# EasyEDA Pro project N630电调_立创EDA专业版工程.epro, board PCB1
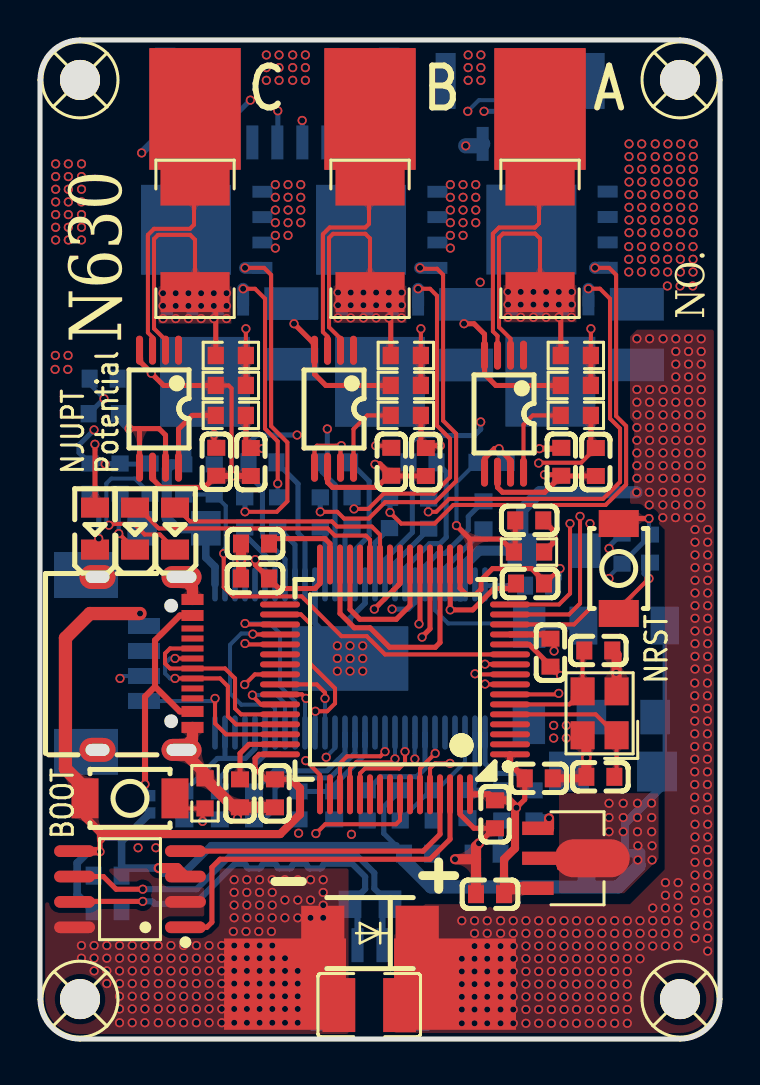
[diagram p5: board, top side]
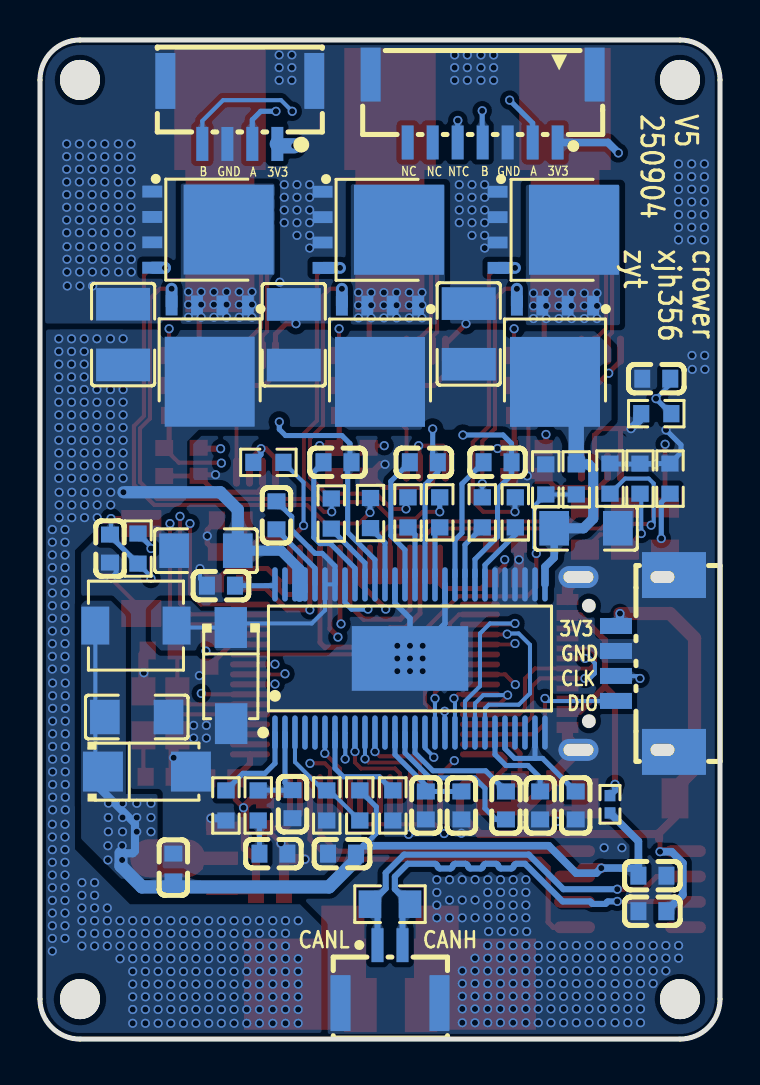
[diagram p6: board, bottom side, seen from below]

Outline 34 x 50 mm; copper layers: Top Layer, Inner1, Inner2, Bottom Layer. Coordinates in mm from the lower left corner of the outline.
Outline path: 0,48 0,2 arc(0.59,0.59) 2,0 32,0 arc(33.41,0.59) 34,2 34,48 arc(33.41,49.41) 32,50 2,50 arc(0.59,49.41) 0,48
Stack: Top Layer 0.035mm 外层铜厚1oz / Dielectric1 0.2104mm 7628 RC49% 8.6mil / Inner1 0.0152mm 内层铜厚 / Dielectric2 1.065mm 1.1mm H/HOZ Copper / Inner2 0.0152mm 内层铜厚 / Dielectric3 0.2104mm 7628 RC49% 8.6mil / Bottom Layer 0.035mm 外层铜厚1oz

## Design rules (mm)
net CANL: DP1
net CANH: DP1
template: 自定义配置
spacing copperThickness1oz (default): track to track 0.102, other pairs 0.152 to 0.3
spacing copperThickness2oz: track to track 0.203, other pairs 0.152 to 0.3
track width copperThickness1oz (default): min 0.127, default 0.254, max 2.54
track width copperThickness2oz: min 0.203, default 0.254, max 2.54
differential pair differentialPair (default): width min 0.127, default 0.254, max 2.54; gap min 0.152, default 0.152
via viaSize (default): diameter min 0.399, default 0.399, max 10; hole min 0.201, default 0.201, max 6.299
net PH_A uses pwr
net PH_C uses pwr
net SUPPLY uses pwr

## Placement (name value [footprint] x y rotation side)
C2  15pF  [C0603]  28.02 13.12 180 top
C3  2.2uF  [C0603]  10.75 24.8 0 top
C4  2.2uF  [C0603]  10 12.3 270 top
C5  2.2uF  [C0603]  24.94 13.05 180 top
C6  2.2uF  [C0603]  25.52 19.34 90 top
C7  100nF  [C0603]  30.5 24.55 270 bottom
C8  15pF  [C0603]  27.91 19.45 0 top
C9  2.2uF  [C0603]  24.5 22.8 180 top
C10  2.2uF  [C0603]  11.75 12.3 90 top
C11  2.2uF  [C0603]  22.75 11.25 90 top
C12  2.2uF  [C0603]  10.75 23.05 0 top
C13  10uF  [C0603]  27.33 8.58 270 bottom
C14  2.2uF  [C0603]  12.93 11.69 90 bottom
C15  2.2uF  [C0603]  14.71 11.69 90 bottom
C16  6.8nF  [C0603]  22.33 9.28 180 bottom
C17  2.2uF  [C0603]  8.99 11.69 90 bottom
C18  120pF  [C0603]  21.38 11.76 270 bottom
C19  22nF  [C0603]  10.7 11.69 90 bottom
C20  2.2uF  [C0603]  7.21 11.69 90 bottom
C22  15nF  [C0603]  24.95 22.69 180 bottom
C23  220nF  [C0603]  19.12 28.86 180 bottom
C24  220nF  [C0603]  14.81 28.86 0 bottom
C25  220nF  [C0603]  11.12 28.86 0 bottom
C26  4.7uF  [C1206]  25.7 24.44 180 bottom
C27  4.7uF  [C1206]  6.7 25.56 0 bottom
C28  100nF  [C0603]  22.18 26.21 90 bottom
C29  4.7nF  [C0603]  27.79 28.88 90 top
C30  4.7nF  [C0603]  19.29 28.88 90 top
C31  2.2uF  [C0603]  18.9 9.28 180 bottom
C32  100uF  [C1206]  29.16 16.12 0 bottom
C33  2.2uF  [C0603]  3.38 8.18 0 bottom
C34  2.2uF  [C0603]  3.38 6.4 180 bottom
C35  2.2uF  [C0603]  26.06 28.89 270 top
C36  2.2uF  [C0603]  24.46 25.96 180 top
C37  10uF  [C1210]  29.84 35.26 270 bottom
C38  2.2uF  [C0603]  17.56 28.89 270 top
C40  10uF  [C1210]  21.31 35.25 270 bottom
C42  2.2uF  [C0603]  8.81 28.89 270 top
C43  10uF  [C1210]  12.56 35.29 270 bottom
C45  4.7nF  [C0603]  10.54 28.88 90 top
C58  100nF  [C0603]  3.19 33.05 180 bottom
C64  10uF  [C0603]  22.5 7.25 0 top
C65  10uF  [C1210]  16.46 1.7 180 top
D1  NCD0805R1  [LED0805-R-RD]  2.75 25.55 90 top
D2  KT-0805Y  [LED0805-R-RD]  4.75 25.55 90 top
D3  KT-0805G  [LED0805-R-RD]  6.75 25.55 90 top
D4  SS56  [SMA_L4.3-W2.6-LS5.0-RD]  24.45 18.19 270 bottom
D5  SMAJ5.0A  [SMA_L4.3-W2.6-LS5.2-RD]  28.65 13.38 180 bottom
D6  SMBJ26A  [SMB_L4.4-W3.6-LS5.3-L-RD]  16.5 5.3 180 top
L2  22uH  [IND-SMD_L4.6-W4.2_SMMS0420]  29.2 20.69 180 bottom
NOREF  -  [Pad_e36]  16.5 46.55 90 top
NOREF#2  -  [Pad_e1962]  12.25 2.75 0 top
NOREF#3  -  [Pad_e702]  20.75 2.75 0 top
NOREF#4  -  [Pad_e74]  25 46.55 90 top
NOREF#5  -  [Pad_e10]  7.75 46.55 90 top
P2  WAFER-GH1.25-2PWB  [CONN-TH_2P-P1.25_XUNPU_WAFER-GH1.25-2PWB]  16.5 3.25 180 bottom
P7  532610471  [CONN-SMD_4P-P1.25_53261-0471]  3.75 18.8 90 bottom
P13  WAFER-GH1.25-7PWB  [CONN-SMD_7P-P1.25_FWF12514-S07B24W5M]  11.87 46.57 0 bottom
P14  WAFER-GH1.25-4PWB  [CONN-SMD_4P-P1.25_XUNPU_WAFER-GH1.25-4PWB]  24.01 46.37 0 bottom
Q1  PSMN1R8-40YLC,115  [SOT-669_L4.9-W4.0-P1.27-LS6.0-BL]  25.52 34.81 0 bottom
Q2  PSMN1R8-40YLC,115  [SOT-669_L4.9-W4.0-P1.27-LS6.0-BL]  26.48 40.51 270 bottom
Q3  PSMN1R8-40YLC,115  [SOT-669_L4.9-W4.0-P1.27-LS6.0-BL]  17 34.8 0 bottom
Q4  PSMN1R8-40YLC,115  [SOT-669_L4.9-W4.0-P1.27-LS6.0-BL]  17.96 40.5 270 bottom
Q5  PSMN1R8-40YLC,115  [SOT-669_L4.9-W4.0-P1.27-LS6.0-BL]  8.25 34.8 0 bottom
Q6  PSMN1R8-40YLC,115  [SOT-669_L4.9-W4.0-P1.27-LS6.0-BL]  9.21 40.5 270 bottom
R1  NC  [R0402]  5.5 11.75 270 bottom
R2  10kΩ  [R0603]  29.1 24.55 90 bottom
R3  10kΩ  [R0603]  8.25 12.3 270 top
R7  1kΩ  [R0603]  2.5 28.05 270 bottom
R8  220Ω  [R0603]  4 28.05 270 bottom
R9  220Ω  [R0603]  5.5 28.05 270 bottom
R10  3.3kΩ  [R0603]  19.66 11.69 270 bottom
R11  18kΩ  [R0603]  18.01 11.69 90 bottom
R12  15kΩ  [R0603]  23.09 11.69 270 bottom
R13  10kΩ  [R0603]  16.36 11.69 270 bottom
R14  220kΩ  [R0603]  24.7 11.69 270 bottom
R15  39kΩ  [R0603]  7.19 28.01 90 bottom
R16  2.2kΩ  [R0603]  8.71 28.01 90 bottom
R17  39kΩ  [R0603]  26.79 34.21 180 top
R18  2.2kΩ  [R0603]  26.79 32.71 180 top
R19  39kΩ  [R0603]  18.29 34.21 180 top
R20  2.2kΩ  [R0603]  18.29 32.71 180 top
R21  39kΩ  [R0603]  9.54 34.21 180 top
R22  2.2kΩ  [R0603]  9.54 32.71 180 top
R23  NC(120R)  [R0805]  16.5 6.75 180 bottom
R24  1mΩ  [RES-SMD_L6.3-W3.2_R2512]  25 40.05 270 top
R25  4.7Ω  [R0603]  19.44 26.3 90 bottom
R26  4.7Ω  [R0603]  17.47 26.32 90 bottom
R27  KNTC0603/10KF3950  [R0603]  22.58 28.86 0 bottom
R28  10kΩ  [R0603]  24.45 24.37 180 top
R29  1mΩ  [RES-SMD_L6.3-W3.2_R2512]  16.5 40.05 270 top
R30  4.7Ω  [R0603]  15.6 26.36 90 bottom
R31  4.7Ω  [R0603]  14.01 26.36 90 bottom
R32  1mΩ  [RES-SMD_L6.3-W3.2_R2512]  7.75 40.05 270 top
R33  4.7Ω  [R0603]  11.89 26.36 90 bottom
R34  4.7Ω  [R0603]  10.23 26.36 90 bottom
R35  100Ω  [R0603]  26.79 31.21 180 top
R36  100Ω  [R0603]  18.29 31.21 180 top
R37  100Ω  [R0603]  9.54 31.21 180 top
R39  10kΩ  [R0603]  3.19 31.3 0 bottom
TP1  -  [M2螺丝]  2 2 0 top
TP2  -  [M2螺丝]  2 48 0 top
TP3  -  [M2螺丝]  32 48 0 top
TP4  -  [M2螺丝]  32 2 0 top
U1  STM32F405RGT6  [LQFP-64_L10.0-W10.0-P0.50-LS12.0-BL]  17.75 18 90 top
U2  ME6118A33PG  [SOT-89-3_L4.5-W2.5-P1.50-LS4.2-BR]  26.25 9.05 180 top
U4  TJA1051T/3/1J  [SOIC-8_L4.9-W3.9-P1.27-LS6.0-BL]  4.5 7.5 90 top
U5  INA240A2PWR  [TSSOP-8_L4.4-W3.0-P0.65-LS6.4-BL]  23.2 31.3 180 top
U6  INA240A2PWR  [TSSOP-8_L4.4-W3.0-P0.65-LS6.4-BL]  14.7 31.55 180 top
U7  INA240A2PWR  [TSSOP-8_L4.4-W3.0-P0.65-LS6.4-BL]  5.95 31.55 180 top
U8  GT-TC029A-H030-L1N  [SW-SMD_L3.9-W2.9-P4.15-LS5.0]  28.94 23.55 90 top
U9  DRV8301DCA  [HTSSOP-56_L14.0-W6.0-P0.50-LS8.1-BL-EP]  15.5 19.05 180 bottom
U10  GT-TC029A-H030-L1N  [SW-SMD_L3.9-W2.9-P4.15-LS5.0]  4.5 12.05 180 top
USB1  TYPE-C 16PIN 2MD(073)  [USB-C-SMD_TYPE-C-6PIN-2MD-073]  5.25 18.8 270 top
X1  8MHz  [CRYSTAL-SMD_4P-L3.2-W2.5-BL]  27.98 16.3 90 top

## Footprints (pads in the part's own frame, mm; a bottom-side part is the same pattern mirrored in y, then rotated)
C0603
  rect 0.8x0.9 smd: 1(-0.7,0) 2(0.7,0)
C1206
  rect 1.485x1.728 smd: 1(-1.593,0) 2(1.593,0)
C1210
  rect 1.635x2.7 smd: 1(-1.518,0) 2(1.518,0)
CONN-SMD_4P-P1.25_53261-0471
  rect 0.8x1.6 smd: 1(-1.875,1.45) 2(-0.625,1.45) 3(0.625,1.45) 4(1.875,1.45)
  rect 2.3x3.2 smd: 5(4.425,-1.45) 6(-4.425,-1.45)
CONN-SMD_4P-P1.25_XUNPU_WAFER-GH1.25-4PWB
  rect 0.6x1.7 smd: 1(-1.875,1.575) 2(-0.625,1.575) 3(0.625,1.575) 4(1.875,1.575)
  rect 1x2.8 smd: 5(3.725,-1.575) 6(-3.725,-1.575)
CONN-SMD_7P-P1.25_FWF12514-S07B24W5M
  rect 0.6x1.7 smd: 1(-3.75,1.7) 2(-2.5,1.7) 3(-1.25,1.7) 4(0,1.7) 5(1.25,1.7) 6(2.5,1.7) 7(3.75,1.7)
  rect 1x2.7 smd: 8(-5.6,-1.7) 9(5.6,-1.7)
CONN-TH_2P-P1.25_XUNPU_WAFER-GH1.25-2PWB
  rect 0.6x1.7 smd: 1(-0.625,1.45) 2(0.625,1.45)
  rect 1x2.8 smd: 3(-2.475,-1.45) 4(2.475,-1.45)
CRYSTAL-SMD_4P-L3.2-W2.5-BL
  rect 1.4x1.2 smd: 1(-1.1,-0.85) 2(1.1,-0.85) 3(1.1,0.85) 4(-1.1,0.85)
HTSSOP-56_L14.0-W6.0-P0.50-LS8.1-BL-EP
  oval 0.28x1.715 smd: 1(-6.75,-3.708) 2(-6.25,-3.708) 3(-5.75,-3.708) 4(-5.25,-3.708) 5(-4.75,-3.708) 6(-4.25,-3.708) 7(-3.75,-3.708) 8(-3.25,-3.708) 9(-2.75,-3.708) 10(-2.25,-3.708) 11(-1.75,-3.708) 12(-1.25,-3.708) 13(-0.75,-3.708) 14(-0.25,-3.708) 15(0.25,-3.708) 16(0.75,-3.708) 17(1.25,-3.708) 18(1.75,-3.708) 19(2.25,-3.708) 20(2.75,-3.708) 21(3.25,-3.708) 22(3.75,-3.708) 23(4.25,-3.708) 24(4.75,-3.708) 25(5.25,-3.708) 26(5.75,-3.708) 27(6.25,-3.708) 28(6.75,-3.708) 29(6.75,3.708) 30(6.25,3.708) 31(5.75,3.708) 32(5.25,3.708) 33(4.75,3.708) 34(4.25,3.708) 35(3.75,3.708) 36(3.25,3.708) 37(2.75,3.708) 38(2.25,3.708) 39(1.75,3.708) 40(1.25,3.708) 41(0.75,3.708) 42(0.25,3.708) 43(-0.25,3.708) 44(-0.75,3.708) 45(-1.25,3.708) 46(-1.75,3.708) 47(-2.25,3.708) 48(-2.75,3.708) 49(-3.25,3.708) 50(-3.75,3.708) 51(-4.25,3.708) 52(-4.75,3.708) 53(-5.25,3.708) 54(-5.75,3.708) 55(-6.25,3.708) 56(-6.75,3.708)
  rect 5.825x3.235 smd: 57(0,0)
IND-SMD_L4.6-W4.2_SMMS0420
  rect 1.4x1.9 smd: 1(2.032,0) 2(-2.032,0)
LED0805-R-RD
  rect 1x1.399 smd: 1(1.05,0) 2(-1.05,0)
LQFP-64_L10.0-W10.0-P0.50-LS12.0-BL
  oval 0.3x2 smd: 1(-3.75,-5.75) 2(-3.25,-5.75) 3(-2.75,-5.75) 4(-2.25,-5.75) 5(-1.75,-5.75) 6(-1.25,-5.75) 7(-0.75,-5.75) 8(-0.25,-5.75) 9(0.25,-5.75) 10(0.75,-5.75) 11(1.25,-5.75) 12(1.75,-5.75) 13(2.25,-5.75) 14(2.75,-5.75) 15(3.25,-5.75) 16(3.75,-5.75) 33(3.75,5.75) 34(3.25,5.75) 35(2.75,5.75) 36(2.25,5.75) 37(1.75,5.75) 38(1.25,5.75) 39(0.75,5.75) 40(0.25,5.75) 41(-0.25,5.75) 42(-0.75,5.75) 43(-1.25,5.75) 44(-1.75,5.75) 45(-2.25,5.75) 46(-2.75,5.75) 47(-3.25,5.75) 48(-3.75,5.75)
  oval 2x0.3 smd: 17(5.75,-3.75) 18(5.75,-3.25) 19(5.75,-2.75) 20(5.75,-2.25) 21(5.75,-1.75) 22(5.75,-1.25) 23(5.75,-0.75) 24(5.75,-0.25) 25(5.75,0.25) 26(5.75,0.75) 27(5.75,1.25) 28(5.75,1.75) 29(5.75,2.25) 30(5.75,2.75) 31(5.75,3.25) 32(5.75,3.75) 49(-5.75,3.75) 50(-5.75,3.25) 51(-5.75,2.75) 52(-5.75,2.25) 53(-5.75,1.75) 54(-5.75,1.25) 55(-5.75,0.75) 56(-5.75,0.25) 57(-5.75,-0.25) 58(-5.75,-0.75) 59(-5.75,-1.25) 60(-5.75,-1.75) 61(-5.75,-2.25) 62(-5.75,-2.75) 63(-5.75,-3.25) 64(-5.75,-3.75)
M2螺丝
  round 2 hole 2: 1(0,0)
Pad_e10
  rect 6.096x4.572 smd: (0,0)
Pad_e36
  rect 6.096x4.572 smd: (0,0)
Pad_e74
  rect 6.096x4.572 smd: (0,0)
Pad_e702
  rect 6.096x4.572 smd: (0,0)
Pad_e1962
  rect 6.096x4.572 smd: (0,0)
R0402
  rect 0.566x0.54 smd: 1(-0.433,0) 2(0.433,0)
R0603
  rect 0.806x0.864 smd: 1(-0.753,0) 2(0.753,0)
R0805
  rect 1.133x1.377 smd: 1(-1,0) 2(1,0)
RES-SMD_L6.3-W3.2_R2512
  rect 2x3.456 smd: 1(-2.667,0) 2(2.667,0)
SMA_L4.3-W2.6-LS5.0-RD
  rect 2.046x1.62 smd: 1(-2.404,-0.009) 2(2.404,0.009)
SMA_L4.3-W2.6-LS5.2-RD
  rect 2x2 smd: 1(-2.2,0) 2(2.2,0)
SMB_L4.4-W3.6-LS5.3-L-RD
  rect 2.159x2.743 smd: 1(-2.36,0) 2(2.36,0)
SOIC-8_L4.9-W3.9-P1.27-LS6.0-BL
  oval 0.588x2.045 smd: 1(-1.905,-2.772) 2(-0.635,-2.772) 3(0.635,-2.772) 4(1.905,-2.772) 5(1.905,2.772) 6(0.635,2.772) 7(-0.635,2.772) 8(-1.905,2.772)
SOT-89-3_L4.5-W2.5-P1.50-LS4.2-BR
  rect 1.575x0.672 smd: 1(1.356,-1.5) 3(1.356,1.5)
  custom 5.377x1.9 smd: 2(-1.356,0)
SOT-669_L4.9-W4.0-P1.27-LS6.0-BL
  rect 0.595x1 smd: 1(-1.905,-1.909) 2(-0.635,-1.909) 3(0.635,-1.909) 4(1.905,-1.909)
  rect 4.5x4.5 smd: 5(0,1.909)
SW-SMD_L3.9-W2.9-P4.15-LS5.0
  rect 1.35x2 smd: 1(-2.25,0) 2(2.25,0)
TSSOP-8_L4.4-W3.0-P0.65-LS6.4-BL
  oval 0.353x1.454 smd: 1(-0.975,-2.927) 2(-0.325,-2.927) 3(0.325,-2.927) 4(0.975,-2.927) 5(0.975,2.927) 6(0.325,2.927) 7(-0.325,2.927) 8(-0.975,2.927)
USB-C-SMD_TYPE-C-6PIN-2MD-073
  rect 0.55x1.1 smd: 1(-3.2,2.375) 2(-2.4,2.375) 11(2.4,2.375) 12(3.2,2.375)
  rect 0.3x1.1 smd: 3(-1.75,2.375) 4(-1.25,2.375) 5(-0.75,2.375) 6(-0.25,2.375) 7(0.25,2.375) 8(0.75,2.375) 9(1.25,2.375) 10(1.75,2.375)
  oval 1.1x2 hole 0.6x1.5: 13(-4.325,1.825) 14(4.325,1.825)
  oval 1.2x1.8 hole 0.6x1.2: 13(-4.325,-2.375) 14(4.325,-2.375)

## Nets
As in the schematic, except:
GND: C2.2 C3.1 C4.2 C5.1 C6.1 C7.2 C8.2 C9.1 C10.1 C11.1 C12.1 C13.1 C14.1 C15.1 C16.2 C17.1 C18.2 C20.1 C22.1 C26.1 C27.1 C29.1 C30.1 C31.1 C32.1 C33.1 C34.1 C35.2 C36.1 C37.1 C38.2 C40.1 C42.2 C43.1 C45.1 C58.1 C64.1 C65.2 D4.2 D5.2 D6.2 NOREF#2. P2.3 P2.4 P7.3 P7.5 P7.6 P13.3 P13.8 P13.9 P14.3 P14.5 P14.6 Q2.1 Q2.2 Q2.3 Q4.1 Q4.2 Q4.3 Q6.1 Q6.2 Q6.3 R3.1 R7.1 R8.1 R9.1 R10.2 R13.2 R14.2 R16.2 R18.2 R20.2 R22.2 R28.1 U1.12 U1.18 U1.63 U2.1 U4.2 U4.8 U5.4 U5.6 U6.4 U6.6 U7.4 U7.6 U8.1 U9.28 U9.30 U9.31 U9.32 U9.33 U9.34 U9.39 U9.44 U9.57 USB1.1 USB1.12 USB1.13 USB1.14 X1.2 X1.4
PH_A: NOREF#4. R24.1 U5.3
PH_B: NOREF. R29.1 U6.3
PH_C: NOREF#5. R32.1 U7.3
SUPPLY: C26.2 C27.2 C37.2 C40.2 C43.2 C65.1 D6.1 NOREF#3. Q1.5 Q3.5 Q5.5 R15.2 U9.29 U9.53 U9.54

Pads without a net: P13 6 7; TP1 1; TP2 1; TP3 1; TP4 1; U1 2 3 4 28 50; U5 1; U6 1; U7 1; U9 4 5 12 25 26 55; USB1 3 4 9 10

## Via types
v1: diameter 0.457, hole 0.305, Top Layer to Bottom Layer, 769 vias

## Routing (per net, layer and track width the routed paths; a pad name or vN(x,y) marks a point on that pad's centre or on a via; arc(x,y) is an arc through that point)
+5V: length 51.4
  Top Layer w0.203: 25.95,8.55 27.11,8.55 U2.2
  Top Layer w0.508: v1(5.94,8.56) 6.85,8.56 U4.3
  Bottom Layer w0.203: L2.2 31.23,12.77 31.15,12.69
  Bottom Layer w0.254: R11.2 17.19,11.62 17.19,10.29 17.8,9.67
  Bottom Layer w0.381: 17.8,9.67 8.56,9.67 7.19,8.3 6.19,8.3 v1(5.94,8.56) 4.14,8.56 4.08,8.5 ; 4.08,8.5 C33.2 ; 4.08,8.5 4.08,9.9 R1.2
  Bottom Layer w0.406: 29.95,9.3 29.36,9.3 29.25,9.41 29.25,10.79 31.15,12.69
  Bottom Layer w0.66: C31.2 18.2,8.96 19.55,7.61 28.9,7.61 29.95,8.67 29.95,9.3
  vias: v1(28.45,11.8) v1(28.45,11.09) v1(28.45,10.38) v1(29.16,11.8) v1(29.16,11.09) v1(29.16,10.38) v1(29.87,11.8) v1(29.87,11.09) v1(29.87,10.38) v1(29.89,9.67) v1(29.89,8.96) v1(30.58,11.81) v1(30.58,11.09) v1(30.58,10.38) v1(30.6,9.67) v1(30.6,8.96)
GND: length 104.8
  Top Layer w0.203: v1(26,23.55) 25.25,22.8 C9.1 ; C4.2 10,11.18 v1(9.87,11.05) ; R22.2 9.43,32.71 9.58,32.56 9.58,28.24 v1(9.64,28.18) ; U8.1 28.94,21.53 v1(30.45,23.05)
  Top Layer w0.254: R20.2 14.29,32.71 13.73,33.27 U6.4 13.73,34.77 v1(12.7,35.8) ; v1(26.03,18.19) 25.58,18.64 C6.1 25.52,18.68 24.46,19.75 U1.12 ; C35.2 25.24,27.36 23.12,27.36 22.88,27.61 U5.6 ; C35.2 26.08,28.18 C29.1 ; C35.2 26.01,28.24 v1(25.22,28.24) ; C42.2 8.81,28.18 8.23,27.61 6.05,27.61 5.63,28.03 U7.6 ; R18.2 22.79,32.71 22.23,33.27 U5.4 22.23,35.27 21.7,35.8 v1(21.2,35.8) ; 25.19,22.93 24.58,23.54 22.62,23.54 22.05,22.97 22.05,22.5 21.79,22.25 21.31,22.25 21,22.56 U1.18 ; 25.16,25.96 25.64,25.48 v1(25.64,25.18) 25.64,24.81 R28.1 ; U6.6 14.38,27.86 14.63,27.61 16.84,27.61 17.47,28.24 16.95,28.76 ; 22.7,10.55 21.7,10.55 21,11.25 U1.63 ; 22.7,10.55 v1(21.95,9.8) ; 22.7,10.55 C11.1 ; U7.4 4.98,33.93 5.56,33.34 v1(5.56,33.32) 6.18,32.71 R22.2 ; C30.1 17.58,28.18
  Top Layer w0.28: C9.1 25.19,22.81 25.19,22.93
  Top Layer w0.305: C38.2 16.99,28.76 v1(16.75,28.76) ; C45.1 10.54,28.18 v1(9.64,28.18) 8.81,28.18
  Top Layer w0.406: C2.2 27.24,13.05 C5.1
  Top Layer w0.508: X1.4 27.32,15.01 v1(27.32,14.08) C2.2 ; 28.83,17.4 28.83,19.23 C8.2 ; 21.8,9 21.8,9.65 v1(21.95,9.8) ; 21.8,9 C64.1 ; 21.8,9 v1(20.75,9) ; C12.1 v1(10.05,23.99) C3.1 ; U2.1 25.45,10.55 25.45,10.55 v1(25.45,11.05)
  Top Layer w0.559: USB1.12 7.63,15.02 USB1.14 8.25,13.3 R3.1 9.7,11.6 C4.2 C10.1 ; USB1.1 7.63,22.57 7.08,23.12
  Bottom Layer w0.203: C22.1 26,23.04 v1(26,23.55) ; v1(21.2,35.8) 21.31,35.91 C40.1 ; C43.1 12.7,36.67 v1(12.7,35.8) ; 30.2,23.54 C7.2
  Bottom Layer w0.254: v1(2.7,30.49) 1.95,29.74 1.95,29.35 R7.1 R8.1 3.98,28.78 ; v1(30.45,23.05) 30.2,23.3 30.2,23.54 ; 3.98,28.78 5.48,28.78 R9.1 ; 3.98,28.78 v1(3.26,28.78)
  Bottom Layer w0.28: U9.39 13.75,20.8 v1(14.87,19.68) ; v1(15.5,19.05) v1(15.5,19.68) 15.5,21.06 16.25,21.81 U9.44
  Bottom Layer w0.406: R14.2 24.81,11.05 v1(25.45,11.05)
  vias: v1(0.78,43.8) v1(0.78,43.16) v1(0.78,42.53) v1(0.78,41.89) v1(0.78,41.26) v1(0.78,40.62) v1(0.78,39.99) v1(0.77,34.21) v1(0.75,33.51) v1(1.39,33.51) v1(1.42,43.8) v1(1.42,43.16) v1(1.42,42.53) v1(1.42,41.89) v1(1.42,41.26) v1(1.42,40.62) v1(1.42,39.99) v1(1.4,34.21) v1(2.08,43.8) v1(2.08,43.16) v1(2.08,42.53) v1(2.07,41.9) v1(2.07,41.26) v1(2.07,40.63) v1(2.07,39.99) v1(2.07,4.68) v1(2.07,4.05) v1(2.71,4.68) v1(2.71,4.05) v1(2.71,3.41) v1(3.34,4.68) v1(3.34,4.05) v1(3.34,3.41) v1(3.34,2.78) v1(3.98,4.68) v1(3.98,4.05) v1(3.98,3.41) v1(3.98,2.78) v1(3.98,2.14) v1(3.98,1.51) v1(3.98,0.82) v1(4.61,4.68) v1(4.61,4.05) v1(4.61,3.41) v1(4.61,2.78) v1(4.61,2.14) v1(4.61,1.51) v1(4.61,0.82) v1(4.9,9.57) v1(5.25,4.68) v1(5.25,4.05) v1(5.25,3.41) v1(5.25,2.78) v1(5.25,2.14) v1(5.25,1.51) v1(5.25,0.82) v1(5.79,9.57) v1(5.91,4.68) v1(5.91,4.05) v1(5.91,3.41) v1(5.91,2.78) v1(5.91,2.14) v1(5.91,1.51) v1(5.91,0.82) v1(6.55,4.68) v1(6.55,4.05) v1(6.55,3.41) v1(6.55,2.78) v1(6.55,2.14) v1(6.55,1.51) v1(6.55,0.82) v1(7.18,4.68) v1(7.18,4.05) v1(7.18,3.41) v1(7.18,2.78) v1(7.18,2.14) v1(7.18,1.51) v1(7.18,0.82) v1(7.82,4.68) v1(7.82,4.05) v1(7.82,3.41) v1(7.82,2.78) v1(7.82,2.14) v1(7.82,1.51) v1(7.82,0.82) v1(8.45,4.68) v1(8.45,4.05) v1(8.45,3.41) v1(8.45,2.78) v1(8.45,2.14) v1(8.45,1.51) v1(8.45,0.82) v1(9.09,4.68) v1(9.09,4.05) v1(9.09,3.41) v1(9.09,2.78) v1(9.09,2.14) v1(9.09,1.51) v1(9.09,0.82) v1(9.67,5.38) v1(9.71,7.98) v1(9.71,7.34) v1(9.71,6.71) v1(9.71,6.07) v1(9.71,4.68) v1(9.71,4.05) v1(9.71,3.41) v1(9.71,2.78) v1(9.71,2.14) v1(9.71,1.51) v1(9.71,0.82) v1(10.34,7.98) v1(10.34,7.34) v1(10.34,6.71) v1(10.34,6.07) v1(10.3,5.38) v1(10.34,4.68) v1(10.34,4.05) v1(10.34,3.41) v1(10.34,2.78) v1(10.34,2.14) v1(10.34,1.51) v1(10.34,0.82) v1(10.98,7.98) v1(10.98,7.34) v1(10.98,6.71) v1(10.98,6.07) v1(10.94,5.38) v1(10.98,4.68) v1(10.98,4.05) v1(10.98,3.41) v1(10.98,2.78) v1(10.98,2.14) v1(10.98,1.51) v1(10.98,0.82) v1(11.32,49.25) v1(11.32,48.61) v1(11.32,47.98) v1(11.57,5.38) v1(11.61,7.98) v1(11.61,7.34) v1(11.61,6.71) v1(11.61,6.07) v1(11.62,4.68) v1(11.62,4.05) v1(11.62,3.41) v1(11.62,2.78) v1(11.62,2.14) v1(11.62,1.51) v1(11.62,0.82) v1(11.77,42.76) v1(11.77,42.12) v1(11.77,41.49) v1(11.77,40.85) v1(11.77,40.22) v1(11.77,39.58) v1(11.95,49.25) v1(11.95,48.61) v1(11.95,47.98) v1(12.25,7.98) v1(12.25,6.96) v1(12.25,6.07) v1(12.25,4.05) v1(12.25,3.41) v1(12.25,2.78) v1(12.25,2.14) v1(12.25,1.51) v1(12.25,0.82) v1(12.4,42.76) v1(12.4,42.12) v1(12.4,41.49) v1(12.4,40.85) v1(12.4,40.22) v1(12.63,49.25) v1(12.63,48.62) v1(12.63,47.98) v1(12.89,7.97) v1(12.89,6.96) v1(12.89,6.07) v1(12.89,3.41) v1(12.89,2.78) v1(12.89,2.14) v1(12.89,1.51) v1(12.89,0.82) v1(12.93,10.3) v1(13.04,42.76) v1(13.04,42.12) v1(13.04,41.49) v1(13.04,40.85) v1(13.27,49.25) v1(13.27,48.62) v1(13.27,47.98) v1(13.52,7.97) v1(13.52,6.96) v1(13.52,6.07) v1(14.16,7.97) v1(14.16,7.34) v1(14.16,6.7) v1(14.16,6.07) v1(14.87,19.05) v1(14.87,18.41) v1(15.5,18.41) v1(15.57,10.25) v1(16.14,19.68) v1(16.14,19.05) v1(16.14,18.41) v1(20.52,42.76) v1(20.52,42.12) v1(20.52,41.49) v1(20.52,40.85) v1(20.52,40.22) v1(20.52,39.58) v1(21.15,42.76) v1(21.15,42.12) v1(21.15,41.49) v1(21.15,40.85) v1(21.15,40.22) v1(21.41,49.25) v1(21.41,48.62) v1(21.41,47.98) v1(21.79,42.76) v1(21.79,42.12) v1(21.79,41.49) v1(21.79,40.85) v1(22.04,49.25) v1(22.04,48.62) v1(22.04,47.98) v1(22.01,37.88) v1(25.68,15.7) v1(25.68,15.06) v1(26.32,15.7) v1(26.32,15.06) v1(28.81,18.33) v1(29.45,44.8) v1(29.45,44.16) v1(29.45,43.53) v1(29.45,42.89) v1(29.45,42.26) v1(29.45,41.62) v1(29.45,40.99) v1(29.45,40.35) v1(29.44,39.66) v1(29.44,39.02) v1(29.44,38.39) v1(30.09,44.8) v1(30.09,44.16) v1(30.09,43.53) v1(30.09,42.89) v1(30.09,42.26) v1(30.09,41.62) v1(30.09,40.99) v1(30.09,40.35) v1(30.07,39.66) v1(30.07,39.02) v1(30.07,38.39) v1(30.76,44.8) v1(30.76,44.16) v1(30.76,43.53) v1(30.76,42.89) v1(30.76,42.26) v1(30.76,41.62) v1(30.76,40.99) v1(30.76,40.35) v1(30.75,39.66) v1(30.75,39.02) v1(30.75,38.39) v1(31.4,44.8) v1(31.4,44.16) v1(31.4,43.53) v1(31.4,42.89) v1(31.4,42.26) v1(31.4,41.62) v1(31.4,40.99) v1(31.4,40.35) v1(31.38,39.66) v1(31.38,39.02) v1(31.38,38.39) v1(31.37,37.69) v1(32.03,44.8) v1(32.03,44.16) v1(32.03,43.53) v1(32.03,42.89) v1(32.03,42.26) v1(32.03,41.62) v1(32.03,40.99) v1(32.03,40.35) v1(32.02,39.66) v1(32.02,39.02) v1(32.02,38.39) v1(32,37.69) v1(32.67,44.8) v1(32.67,44.16) v1(32.67,43.53) v1(32.67,42.89) v1(32.67,42.26) v1(32.67,41.62) v1(32.67,40.99) v1(32.67,40.35) v1(32.65,39.66) v1(32.65,39.02) v1(32.65,38.39) v1(32.64,37.69)
VCC: length 195.9
  Top Layer w0.203: U6.5 13.73,29.57 13.85,29.7 v1(15.07,29.7) 15.03,29.66 U6.7 ; C38.1 17.46,29.7 v1(16.79,29.7)
  Top Layer w0.254: v1(23.82,11.58) 24.24,11.99 C5.2 ; 4.99,30.55 4.98,30.54 U7.5 ; 4.99,30.55 v1(4.45,30.55) ; 4.99,30.55 5.95,30.55 6.28,30.22 U7.7 ; v1(25.7,19.42) 25.7,19.86 C6.2 ; U5.7 23.53,28.97 v1(22.95,29.55) 22.72,29.55 22.23,29.06 U5.5 ; C42.1 8.7,29.7 v1(8.7,30.26) ; D1.1 2.75,29.76 v1(2.74,29.77) ; U1.19 20.51,23.74 v1(20.51,21.48) 21.63,21.48 22.7,22.55 23.5,22.55 23.75,22.8 C9.2 ; 12.55,13 C10.2 11.3,13 10.75,13.55 10.75,14.05 10.95,14.25 U1.48 ; U1.32 14,22.8 13.75,22.55 11.95,22.55 C12.2 10.76,23.73 v1(10.76,23.99) ; v1(3,9.38) 3,9.95 3.05,10
  Top Layer w0.305: U1.1 23.5,13.79 C5.2 ; C11.2 22.45,12.25 U1.64 ; U1.13 25.31,20.25 C6.2 ; C35.1 26.02,29.55 v1(24.97,29.55)
  Top Layer w0.406: 12.55,13 13,12.55 13,11.25 12.01,10.26 3.05,10.26 ; 3.05,10.26 3.05,10 ; 3.05,10.26 3.05,10.31 2.25,11.11 U10.2 ; v1(3,9.38) 2.97,9.41 U4.5 ; C11.2 23.45,11.95 v1(23.82,11.58) 23.75,11.51 23.75,9.55 23.2,9 C64.2
  Top Layer w0.61: U2.3 23.5,7.55 C64.2
  Top Layer w0.66: U10.2 2.25,12.55 1.27,13.53 1.27,20.07 2.5,21.3 v1(5,21.3)
  Inner1 w0.254: v1(10.76,23.99) 10.76,22.8
  Inner1 w0.305: v1(24.97,29.55) v1(22.95,29.55) 20.92,29.55 20.24,30.23 19.8,30.23 19.26,29.7 v1(16.79,29.7) v1(15.07,29.7) 11.96,29.7 11.4,30.26 v1(8.7,30.26) 7.04,30.26 6.68,29.89 4.89,29.89
  Inner1 w0.559: v1(20.51,21.48) 20.51,21.47 20.5,21.46 ; v1(25.7,19.42) 25.19,19.42 ; 20.5,21.46 17.66,21.46 v1(17.6,21.52) 17.6,21.56 16.37,22.8 9.45,22.8 7.95,24.3 5,24.3 v1(5,21.3) ; 20.5,21.46 20.91,21.06 20.91,17.37 21.46,16.81 23.82,16.81 23.82,16.81 ; 4.78,29.77 v1(2.74,29.77)
  Inner1 w0.66: 4.75,30.04 4.78,30.01 4.78,29.77 5,29.77 5,24.3 ; v1(28.45,24.55) 28.45,24.45 28.34,24.34 25.76,24.34 25.19,23.76 25.19,18.17 23.82,16.81 v1(23.82,11.58)
  Inner1 w0.762: v1(21.29,44.7) 5.54,44.7 4.75,43.92 4.75,30.04
  Bottom Layer w0.254: v1(17.6,21.52) 18.42,21.52 18.75,21.85 18.75,22.75 ; R2.2 28.45,24.65 v1(28.45,24.55) ; 23.33,28.86 22.95,29.24 v1(22.95,29.55)
  Bottom Layer w0.381: v1(3,9.38) 2.42,9.38 1.86,8.81 1.86,7.22 C34.2 ; v1(5.08,44.35) 5.6,44.87 P13.1
  Bottom Layer w0.406: v1(4.45,30.55) 4.04,30.96 4.04,31.19 R39.2 ; v1(5,21.3) 5,20.67
  Bottom Layer w0.762: v1(21.29,44.7) 22.04,44.7 22.13,44.8
ADC_TEMP: length 9.9
  Top Layer w0.254: U1.17 21.5,25.02 ; 21.5,25.02 v1(20.82,25.7) ; 21.5,25.02 23.05,25.02 R28.2 23.76,24.44 C36.2
  Bottom Layer w0.203: R27.1 20.82,27.86 v1(20.82,25.7)
AN_IN: length 22.2
  Top Layer w0.203: v1(9.19,24.3) 9.19,22.61 9.64,22.15 13.08,22.15 15.07,20.16 16.34,20.16 17.25,19.25 U1.11
  Bottom Layer w0.203: v1(9.19,24.3) 9.19,24.49 9.29,24.59 9.29,26.68 R16.1 R15.1
BOOT0: length 21.8
  Top Layer w0.203: U10.1 7.25,11.54 R3.2 8.13,11.42 v1(8.13,10.9) ; v1(20.5,13.8) 19.75,13.8 19.5,13.55 U1.60
  Inner1 w0.203: v1(8.13,10.9) 9.34,10.9 9.67,10.57 10.07,10.57 10.4,10.9 12.84,10.9 12.94,11 13.5,11 13.77,11.27 13.77,14.31 14.2,14.74 14.81,14.74 16.5,13.05 19.25,13.05 20,13.8 v1(20.5,13.8)
C_A: length 4.4
  Top Layer w0.203: U5.8 24.18,30.75 24.63,31.21 R35.2
C_B: length 4.1
  Top Layer w0.203: R36.2 16.36,31.21 15.68,30.52 U6.8
C_C: length 4
  Top Layer w0.254: U7.8 6.93,30.52 7.61,31.21 R37.2
CAN_RX: length 15.1
  Top Layer w0.254: U1.61 20,10.25 19.16,9.41 U4.4
CAN_TX: length 18.9
  Top Layer w0.254: U4.1 8.34,5.59 8.59,5.85 8.59,8.59 9,9 19.5,9 20.5,10 U1.62
CANH: length 20.4
  Top Layer w0.254: U4.7 1.75,6.89 v1(5.14,6.89)
  Bottom Layer w0.305: v1(5.14,6.89) 5.61,6.89 arc(5.65,6.87) 5.67,6.83 arc(5.69,6.78) 5.73,6.76 6.37,6.76 arc(6.41,6.78) 6.43,6.83 arc(6.45,6.87) 6.5,6.89 7.87,6.89 9.75,8.77 10.2,8.77 arc(10.28,8.74) 10.32,8.66 arc(10.35,8.57) 10.44,8.54 10.96,8.54 arc(11.04,8.57) 11.08,8.66 arc(11.11,8.74) 11.2,8.77 11.72,8.77 arc(11.81,8.74) 11.84,8.66 arc(11.88,8.57) 11.96,8.54 12.49,8.54 arc(12.57,8.57) 12.6,8.66 arc(12.64,8.74) 12.72,8.77 13.25,8.77 arc(13.33,8.74) 13.37,8.66 arc(13.4,8.57) 13.48,8.54 14.01,8.54 arc(14.09,8.57) 14.13,8.66 arc(14.16,8.74) 14.25,8.77 15.61,8.77 16.26,8.13 16.26,7.51 R23.2 15.88,6.38 P2.2
CANL: length 20.4
  Top Layer w0.254: U4.6 3.17,8.13 3.8,7.5 v1(5.14,7.5)
  Bottom Layer w0.305: v1(5.14,7.5) 7.83,7.5 9.56,9.23 15.8,9.23 16.71,8.32 16.71,7.54 R23.1 17.12,6.38 P2.1
CS: length 15.1
  Top Layer w0.203: v1(10.23,17.74) 10.74,18.25 U1.40
  Inner1 w0.203: v1(18.74,14.02) 18.27,13.55 17.96,13.55 17.95,13.54 16.76,13.54 15.25,15.05 10.75,15.05 10.14,15.66 10.14,17.64 v1(10.23,17.74)
  Bottom Layer w0.203: U9.8 18.73,15.32 18.73,14.19 18.74,14.18 v1(18.74,14.02)
CURRENT_1: length 19.2
  Top Layer w0.203: v1(24.93,28.82) 24.95,28.84 27.06,28.84 C29.2 ; v1(22.25,17.77) 22.27,17.75 U1.8
  Top Layer w0.254: C29.2 27.54,29.83 R35.1
  Inner1 w0.203: v1(24.93,28.82) 24.15,28.82 23.7,28.37 23.7,18.56 22.9,17.77 v1(22.25,17.77)
CURRENT_2: length 19.1
  Top Layer w0.203: v1(21.75,18.28) 21.78,18.25 U1.9
  Top Layer w0.254: 19.41,29.7 19.1,29.7 19.04,29.75 R36.1 ; 19.41,29.7 v1(20.02,29.7) ; 19.41,29.7 C30.2
  Inner1 w0.203: v1(21.75,18.28) 22.61,18.28 23.06,18.74 23.06,27.86 22.18,28.75 20.52,28.75 20.02,29.26 v1(20.02,29.7)
CURRENT_3: length 24.9
  Top Layer w0.203: U1.10 23.49,18.76 v1(22.25,18.76)
  Top Layer w0.254: v1(11.12,29.55) 10.57,29.55 ; 10.57,29.55 10.55,29.55 10.29,29.81 R37.1 ; 10.57,29.55 C45.2
  Inner1 w0.203: v1(22.25,18.76) 22.5,19.01 22.5,27.24 21.46,28.28 11.77,28.28 11.12,28.92 v1(11.12,29.55)
EN_GATE: length 11.2
  Top Layer w0.203: v1(13.79,10.29) 14.26,10.75 17.8,10.75 18,10.95 U1.57
  Inner1 w0.203: v1(13.79,10.29) 14.07,10.56 14.07,13.86 v1(14.31,14.1)
  Bottom Layer w0.203: U9.16 14.75,14.56 14.31,14.12 v1(14.31,14.1)
FAULT: length 3.4
  Top Layer w0.203: U1.59 19,13.54 v1(19.76,14.3)
  Bottom Layer w0.203: v1(19.76,14.3) 19.76,15.33 U9.6
GH_A: length 3.1
  Bottom Layer w0.254: 17.75,23.14 17.75,23.83 19.44,25.51 R25.1
GH_B: length 2.6
  Bottom Layer w0.254: R30.1 15.25,25.25 15.25,23.14
GH_C: length 2.8
  Bottom Layer w0.254: 12.75,23.14 12.75,24.74 R33.1
GL_A: length 2.7
  Bottom Layer w0.254: R26.1 17.47,25.56 16.75,24.84 16.75,23.14
GL_B: length 2.6
  Bottom Layer w0.254: R31.1 14.25,25.37 14.25,23.14
GL_C: length 3.1
  Bottom Layer w0.254: R34.1 10.23,25.24 11.75,23.73 11.75,23.14
H1: length 4.4
  Top Layer w0.203: v1(14.25,17.05) 14.25,17.33 13.84,17.75 U1.41
  Bottom Layer w0.203: v1(14.25,17.05) U9.17
H2: length 3.1
  Top Layer w0.203: U1.42 13.1,17.25 v1(13.3,17.05)
  Bottom Layer w0.203: v1(13.3,17.05) 13.25,17 U9.19
H3: length 4.9
  Top Layer w0.203: U1.43 11.05,16.75 10.62,17.18 v1(10.62,17.21)
  Bottom Layer w0.203: U9.21 12.25,16.8 11.83,17.21 v1(10.62,17.21)
HALL_1: length 1.8
  Top Layer w0.203: U1.37 10.3,19.75 v1(10.25,19.8)
INL_A: length 8.4
  Top Layer w0.203: U1.34 13.05,21.25 13.5,20.8 13.5,18.8 14.75,17.55 14.75,16.8 14.36,16.41 v1(13.77,16.41)
  Bottom Layer w0.203: v1(13.77,16.41) 13.77,15.36 U9.18
INL_B: length 9
  Top Layer w0.203: U1.35 10.3,20.75 v1(10.25,20.8)
  Bottom Layer w0.203: U9.20 12.75,16.91 12,17.66 12,20.3 11.5,20.8 v1(10.25,20.8)
INL_C: length 9
  Top Layer w0.203: v1(10.64,20.27) 10.66,20.25 U1.36
  Bottom Layer w0.203: U9.22 11.75,16.55 11.56,16.73 10.06,16.73 9.5,17.3 9.5,19.73 10.07,20.3 10.61,20.3 v1(10.64,20.27)
LED_GREEN: length 12.3
  Top Layer w0.203: U1.26 17,25.24 16.59,25.65 14.85,25.65 14.59,25.91 7.5,25.91 6.8,26.6 D3.1
LED_RED: length 13.7
  Top Layer w0.203: U1.27 16.5,24.99 16.29,25.2 14.74,25.2 14.38,25.56 5.94,25.56 4.9,26.6 D2.1
MISO_ADC_EXT2: length 73.7
  Top Layer w0.254: U1.22 19,20.83 v1(18.95,20.78)
  Inner1 w0.203: v1(21.39,46.43) 21.36,46.46 v1(11.89,46.46) 4.34,46.46 3.35,45.46 3.35,32.89 1.39,30.92 1.39,20.94 2.19,20.14 6.69,20.14 8.42,21.87 15.42,21.87 16.51,20.78 v1(18.95,20.78)
  Bottom Layer w0.203: v1(21.39,46.43) 21.95,46.99 24.84,46.99 25.88,45.95 25.88,44.8
  Bottom Layer w0.254: v1(11.89,46.46) 11.89,44.89 P13.4
NRST: length 15.5
  Top Layer w0.203: v1(25.94,17.3) 25.89,17.25 U1.7
  Top Layer w0.254: U8.2 29.19,26.05 v1(30.45,26.05)
  Inner1 w0.203: v1(28.45,23.05) 27.14,23.05 26.62,22.53 26.62,17.96 25.96,17.3 v1(25.94,17.3)
  Bottom Layer w0.203: v1(30.45,26.05) 30.45,25.3 C7.1 ; R2.1 28.45,23.14 v1(28.45,23.05)
  Bottom Layer w0.254: C7.1 30.5,25.19 R2.1
PH_A: length 14.2
  Top Layer w0.203: 22.88,34.54 22.88,35.19 22.65,35.42 22.65,40.31 22.95,40.61 24.75,40.61 24.95,40.82 24.95,43.13 25,43.18
  Top Layer w0.254: 25,46.55 25,43.11
PH_B: length 14.2
  Top Layer w0.203: 16.5,43.15 16.45,43.1 16.45,40.8 16.27,40.62 14.48,40.62 14.15,40.28 14.15,35.39 14.38,35.16 14.38,34.51
  Top Layer w0.254: 16.5,46.55 16.5,43.11
PH_C: length 14.2
  Top Layer w0.203: 7.75,43.11 7.7,43.06 7.7,40.75 7.5,40.55 5.7,40.55 5.4,40.24 5.4,35.35 5.63,35.12 U7.3
  Top Layer w0.254: 7.75,46.55 7.75,43.11
RX_SDA_NSS: length 12.2
  Top Layer w0.254: U1.20 20,19.84 19.76,19.61 17.48,19.61 16.5,20.58 15.72,20.58 15,21.3 U1.30
SCK_ADC_EXT: length 74.5
  Top Layer w0.254: U1.21 19.5,20.53 19.1,20.13 v1(19.1,20.12)
  Inner1 w0.203: v1(19.1,20.12) 16.66,20.12 15.29,21.49 8.54,21.49 6.83,19.78 2.05,19.78 1.04,20.79 1.04,31.26 2.87,33.09 2.87,45.74 4.07,46.94 21.69,46.94 v1(22.2,46.43)
  Bottom Layer w0.254: v1(22.2,46.43) 22.96,46.43 23.38,46.01 23.38,44.8 ; v1(10.52,46.99) 9.37,45.84 P13.2
SCLK: length 5
  Top Layer w0.203: v1(17.25,14.39) 17.02,14.15 15.35,14.15 15,13.8 U1.51
  Bottom Layer w0.203: v1(17.25,14.39) U9.11
SDI: length 5
  Top Layer w0.203: v1(18.25,14.39) 18.25,13.84 17.95,13.54 16.24,13.54 16,13.3 U1.53
  Bottom Layer w0.203: U9.9 v1(18.25,14.39)
SDO: length 5.1
  Top Layer w0.203: v1(17.75,14.02) 17.57,13.85 15.8,13.85 15.5,13.55 U1.52
  Bottom Layer w0.203: U9.10 v1(17.75,14.02)
SENS_A: length 21.2
  Top Layer w0.203: R17.1 v1(27.54,35.55) ; v1(27.5,25.8) 27.5,21.55 26.7,20.75 U1.14
  Top Layer w0.254: R17.1 R18.1
  Inner1 w0.203: v1(27.54,35.55) 27.5,35.5 v1(27.5,25.8)
SENS_B: length 27.3
  Top Layer w0.203: R19.1 v1(19.04,35.55) ; v1(27,26.16) 27,21.8 26.45,21.25 U1.15
  Top Layer w0.254: R19.1 R20.1
  Inner1 w0.203: v1(19.04,35.55) 19.04,31.75 19.79,31.01 21.06,31.01 21.67,30.4 26.62,30.4 27,30.02 v1(27,26.16)
SENS_C: length 34.5
  Top Layer w0.203: v1(26.5,25.8) 26.5,22.3 25.95,21.75 U1.16 ; R21.1 v1(10.29,35.55)
  Top Layer w0.254: R21.1 R22.1
  Inner1 w0.203: v1(26.5,25.8) 26.5,29.72 26.19,30.03 21.28,30.03 20.65,30.66 15.34,30.66 14.74,30.05 13.97,30.05 12.22,31.8 10.75,31.8 10.29,32.25 v1(10.29,35.55)
SH_A: length 32.5
  Top Layer w0.203: 23.53,34.54 23.53,35.05 22.95,35.63 22.95,40.11 23.15,40.31 24.76,40.31 25,40.06 25,37.05
  Top Layer w0.254: R17.2 26.04,36.76 25.82,36.98 25,36.98
  Inner1 w0.203: v1(23.4,36.12) 23.4,31.5 22.78,30.88 v1(22.03,30.88)
  Bottom Layer w0.254: 17.25,23.14 17.25,23.99 18.62,25.35 18.62,28.67 C23.2 18.5,28.94 18.5,29.8 18.91,30.2 21.72,30.2 22.03,30.51 v1(22.03,30.88)
  vias: v1(23.4,37.39) v1(23.4,36.76) v1(24.04,37.39) v1(24.04,36.76) v1(24.04,36.12) v1(24.67,37.39) v1(24.67,36.76) v1(24.67,36.12) v1(25.31,37.39) v1(25.31,36.76) v1(25.31,36.12) v1(25.94,37.39) v1(25.94,36.76) v1(25.94,36.12) v1(26.58,37.39) v1(26.58,36.76) v1(26.58,36.12)
SH_B: length 28.4
  Top Layer w0.203: 16.5,37.05 16.5,40.07 16.27,40.3 14.65,40.3 14.45,40.1 14.45,35.63 15.03,35.05 15.03,34.54
  Top Layer w0.254: 16.5,36.98 17.07,36.98 17.54,36.51 R19.2
  Inner1 w0.254: v1(14.9,36.09) 14.9,31.07 v1(14.37,30.53)
  Bottom Layer w0.254: v1(14.37,30.53) 14.37,29.12 C24.1 14.11,28.38 14.75,27.74 14.75,22.89
  vias: v1(14.9,37.36) v1(14.9,36.73) v1(15.54,37.36) v1(15.54,36.73) v1(15.54,36.09) v1(16.17,37.36) v1(16.17,36.73) v1(16.17,36.09) v1(16.81,37.36) v1(16.81,36.73) v1(16.81,36.09) v1(17.44,37.36) v1(17.44,36.73) v1(17.44,36.09) v1(18.08,37.36) v1(18.08,36.73) v1(18.08,36.09)
SH_C: length 33.1
  Top Layer w0.203: 7.75,36.98 7.75,40 7.51,40.24 5.9,40.24 5.7,40.04 5.7,35.56 6.28,34.99 U7.2
  Top Layer w0.254: 7.75,36.98 8.32,36.98 8.79,36.51 R21.2
  Inner1 w0.254: v1(12.85,30.23) 12.44,30.23 11.63,31.04 10.01,31.04 9.33,31.72 v1(9.33,36.06)
  Bottom Layer w0.254: 12.25,23.14 12.25,24.01 11.12,25.13 11.12,27.53 10.42,28.23 C25.1 10.42,29.81 10.84,30.23 v1(12.85,30.23)
  vias: v1(6.15,37.33) v1(6.15,36.69) v1(6.15,36.06) v1(6.79,37.33) v1(6.79,36.69) v1(6.79,36.06) v1(7.42,37.33) v1(7.42,36.69) v1(7.42,36.06) v1(8.06,37.33) v1(8.06,36.69) v1(8.06,36.06) v1(8.69,37.33) v1(8.69,36.69) v1(8.69,36.06) v1(9.33,37.33) v1(9.33,36.69)
SUPPLY: length 27.6
  Bottom Layer w0.254: U9.53 20.75,22.4 21.02,22.13 21.25,22.37 U9.54
  Bottom Layer w0.381: U9.29 8.75,23.63 8.29,24.09 C27.2
  Bottom Layer w0.508: 21.02,22.13 21.02,23.51 21.95,24.44 C26.2 ; R15.2 6.56,28.76 6.34,28.54 6.34,26.05 6.82,25.56 C27.2
  Bottom Layer w0.61: C26.2 24.11,26.49 24.98,27.37 v1(29.83,27.37)
  Bottom Layer w0.762: R15.2 7.19,31.82 Q5.5
  vias: v1(21.09,5.92) v1(21.09,4.02) v1(21.09,3.38) v1(21.09,2.75) v1(21.09,2.11) v1(21.09,1.48) v1(21.09,0.79) v1(21.73,5.92) v1(21.73,5.29) v1(21.73,4.66) v1(21.73,4.02) v1(21.73,3.38) v1(21.73,2.75) v1(21.73,2.11) v1(21.73,1.48) v1(21.73,0.79) v1(22.36,5.92) v1(22.36,5.29) v1(22.36,4.66) v1(22.36,4.02) v1(22.36,3.38) v1(22.36,2.75) v1(22.36,2.11) v1(22.36,1.48) v1(22.36,0.79) v1(23.03,5.92) v1(23.03,5.29) v1(23.03,4.66) v1(23.03,4.02) v1(23.03,3.38) v1(23.03,2.75) v1(23.03,2.11) v1(23.03,1.48) v1(23.03,0.79) v1(23.66,5.92) v1(23.66,5.29) v1(23.66,4.66) v1(23.66,4.02) v1(23.66,3.38) v1(23.66,2.75) v1(23.66,2.11) v1(23.66,1.48) v1(23.66,0.79) v1(24.3,5.92) v1(24.3,5.29) v1(24.3,4.66) v1(24.3,4.02) v1(24.3,3.38) v1(24.3,2.75) v1(24.3,2.11) v1(24.3,1.48) v1(24.3,0.79) v1(24.93,5.92) v1(24.93,5.29) v1(24.93,4.66) v1(24.93,4.02) v1(24.93,3.38) v1(24.93,2.75) v1(24.93,2.11) v1(24.93,1.48) v1(24.93,0.79) v1(25.57,5.92) v1(25.57,5.29) v1(25.57,4.66) v1(25.57,4.02) v1(25.57,3.38) v1(25.57,2.75) v1(25.57,2.11) v1(25.57,1.48) v1(25.57,0.79) v1(26.2,5.92) v1(26.2,5.29) v1(26.2,4.66) v1(26.2,4.02) v1(26.2,3.38) v1(26.2,2.75) v1(26.2,2.11) v1(26.2,1.48) v1(26.2,0.79) v1(26.83,5.92) v1(26.83,5.29) v1(26.83,4.66) v1(26.83,4.02) v1(26.83,3.38) v1(26.83,2.75) v1(26.83,2.11) v1(26.83,1.48) v1(26.83,0.79) v1(27.46,5.92) v1(27.46,5.29) v1(27.46,4.66) v1(27.46,4.02) v1(27.46,3.38) v1(27.46,2.75) v1(27.46,2.11) v1(27.46,1.48) v1(27.46,0.79) v1(28.09,5.92) v1(28.09,5.29) v1(28.09,4.66) v1(28.09,4.02) v1(28.09,3.38) v1(28.09,2.75) v1(28.09,2.11) v1(28.09,1.48) v1(28.09,0.79) v1(28.73,5.92) v1(28.73,5.29) v1(28.73,4.66) v1(28.73,4.02) v1(28.73,3.38) v1(28.73,2.75) v1(28.73,2.11) v1(28.73,1.48) v1(28.73,0.79) v1(29.37,5.92) v1(29.37,5.29) v1(29.37,4.66) v1(29.37,4.02) v1(29.37,3.38) v1(29.37,2.75) v1(29.37,2.11) v1(29.37,1.48) v1(29.37,0.79) v1(29.84,35.05) v1(29.84,32.51) v1(29.84,31.87) v1(29.84,31.24) v1(29.84,30.6) v1(29.84,29.97) v1(29.84,29.33) v1(29.84,28.7) v1(29.84,28.06) v1(30,5.92) v1(30,5.29) v1(30,4.66) v1(30,4.02) v1(30.48,35.05) v1(30.48,32.51) v1(30.48,31.87) v1(30.48,31.24) v1(30.48,30.6) v1(30.48,29.97) v1(30.48,29.33) v1(30.48,28.7) v1(30.48,28.06) v1(30.46,27.37) v1(30.46,26.73) v1(30.64,6.56) v1(30.64,5.92) v1(30.64,5.29) v1(30.64,4.66) v1(31.15,35.05) v1(31.15,32.51) v1(31.15,31.87) v1(31.15,31.24) v1(31.15,30.6) v1(31.15,29.97) v1(31.15,29.33) v1(31.15,28.7) v1(31.15,28.06) v1(31.14,27.36) v1(31.14,26.73) v1(31.14,26.09) v1(31.27,7.83) v1(31.27,7.19) v1(31.27,6.56) v1(31.27,5.92) v1(31.27,5.29) v1(31.27,4.66) v1(31.79,35.05) v1(31.79,34.41) v1(31.79,33.78) v1(31.79,33.14) v1(31.79,32.51) v1(31.79,31.87) v1(31.79,31.24) v1(31.79,30.6) v1(31.79,29.97) v1(31.79,29.33) v1(31.79,28.7) v1(31.79,28.06) v1(31.78,27.36) v1(31.78,26.73) v1(31.78,26.09) v1(31.91,7.83) v1(31.91,7.19) v1(31.91,6.56) v1(31.91,5.92) v1(31.91,5.29) v1(31.91,4.66) v1(32.42,35.05) v1(32.42,34.41) v1(32.42,33.78) v1(32.42,33.14) v1(32.42,32.51) v1(32.42,31.87) v1(32.42,31.24) v1(32.42,30.6) v1(32.42,29.97) v1(32.42,29.33) v1(32.42,28.7) v1(32.42,28.06) v1(32.41,27.36) v1(32.41,26.73) v1(32.41,26.09) v1(32.75,25.5) v1(32.75,24.86) v1(32.75,24.23) v1(32.75,23.59) v1(32.75,22.96) v1(32.75,22.32) v1(32.75,21.69) v1(32.75,21.06) v1(32.75,20.42) v1(32.75,19.79) v1(32.75,19.15) v1(32.75,18.52) v1(32.74,17.82) v1(32.74,17.18) v1(32.74,16.55) v1(32.74,15.91) v1(32.74,15.28) v1(32.74,14.64) v1(32.74,14.01) v1(32.74,13.38) v1(32.74,12.74) v1(32.74,12.11) v1(32.74,11.47) v1(32.75,10.75) v1(32.75,10.11) v1(32.75,9.48) v1(32.75,8.84) v1(32.75,8.21) v1(32.75,7.57) v1(32.75,6.94) v1(32.75,6.31) v1(32.75,5.67) v1(32.75,5.04) v1(33.06,35.05) v1(33.06,34.41) v1(33.06,33.78) v1(33.06,33.14) v1(33.06,32.51) v1(33.06,31.87) v1(33.06,31.24) v1(33.06,30.6) v1(33.06,29.97) v1(33.06,29.33) v1(33.06,28.7) v1(33.06,28.06) v1(33.05,27.36) v1(33.05,26.73) v1(33.05,26.09) v1(33.39,25.5) v1(33.39,24.86) v1(33.39,24.23) v1(33.39,23.59) v1(33.39,22.96) v1(33.39,22.32) v1(33.39,21.69) v1(33.38,21.06) v1(33.38,20.42) v1(33.38,19.79) v1(33.38,19.15) v1(33.38,18.52) v1(33.37,17.82) v1(33.37,17.18) v1(33.37,16.55) v1(33.37,15.91) v1(33.37,15.28) v1(33.37,14.64) v1(33.37,14.01) v1(33.37,13.38) v1(33.37,12.74) v1(33.37,12.11) v1(33.37,11.47) v1(33.39,10.75) v1(33.39,10.11) v1(33.39,9.48) v1(33.39,8.84) v1(33.39,8.21) v1(33.39,7.57) v1(33.39,6.94) v1(33.38,6.31) v1(33.38,5.67) v1(33.38,5.04) v1(33.38,4.4)
SWCLK: length 16.7
  Top Layer w0.203: v1(13.29,13.93) 14,13.22 U1.49
  Inner1 w0.203: v1(13.29,13.93) 12.9,13.55 4.5,13.55 4.25,13.8 4.25,17.8 v1(4,18.05)
  Bottom Layer w0.203: 5,18.17 4.12,18.17 v1(4,18.05)
SWDIO: length 8.5
  Top Layer w0.203: U1.46 9.3,15.25 8.75,15.8 v1(8.75,17.05)
  Bottom Layer w0.203: v1(8.75,17.05) 8.62,16.92 5,16.92
TEMP_MOTOR: length 57.1
  Top Layer w0.254: U1.24 18,22.8 17.93,22.73 17.93,22.72 17.68,22.47 17.67,22.47 v1(16.71,21.52)
  Inner1 w0.203: v1(13.11,45.97) 4.62,45.97 3.81,45.16 3.81,32.67 1.72,30.58 1.72,21.08 2.33,20.47 6.55,20.47 8.28,22.2 16.03,22.2 v1(16.71,21.52)
  Bottom Layer w0.203: C58.2 2.49,32.76 v1(3.2,32.05)
  Bottom Layer w0.254: P13.5 13.12,45.96 v1(13.11,45.97) ; v1(3.2,32.05) 2.45,31.3 R39.1
TX_SCL_MOSI: length 7.8
  Top Layer w0.254: U1.23 18.5,21.69 17.81,21.01 15.99,21.01 15.5,21.5 U1.29
USB_DM: length 9.7
  Top Layer w0.203: U1.44 10.05,16.25 9.75,16.55 9.75,18.05 9.25,18.55 USB1.7 6.5,18.55 6.25,18.8 6.25,19.3 6.5,19.55 7.62,19.55
USB_DP: length 9.7
  Top Layer w0.203: USB1.8 9,18.05 9.39,17.65 9.39,16.15 9.8,15.75 U1.45 ; USB1.6 v1(6.75,19.05) ; v1(6.75,18.05) 7.62,18.05
  Bottom Layer w0.203: v1(6.75,18.05) 6.5,18.05 6.26,18.29 6.26,18.8 6.5,19.05 v1(6.75,19.05)
$1N80571: length 12.9
  Top Layer w0.305: 5.75,17.64 5.75,19.96 6.99,21.2 USB1.2 ; 5.75,17.64 5.25,17.14 v1(5.25,12.75) ; 5.75,17.64 6.99,16.4 USB1.11
  Bottom Layer w0.305: v1(5.25,12.75) 5.25,12.43 5.5,12.18
$1N82503: length 8.8
  Top Layer w0.203: v1(3.44,25.72) 3.42,25.72 3.35,25.78 4.7,25.78 5.23,25.25 6,25.25 D3.2
  Bottom Layer w0.203: v1(3.44,25.72) 3.31,25.85 3.31,27.8 3.56,28.05 4.74,28.05 R9.2
$1N82508: length 3.1
  Top Layer w0.254: v1(2.94,25.05) 2.94,24.68 D1.2
  Bottom Layer w0.254: v1(2.94,25.05) 2.94,26.86 R7.2
$1N82510: length 3.2
  Top Layer w0.203: D2.2 3.95,25.3 v1(3.94,25.3)
  Bottom Layer w0.203: R8.2 3.94,27.23 v1(3.94,25.3)
$2N17028: length 6
  Top Layer w0.203: U1.6 26.47,16.75 X1.3 27.13,19.36 C8.1
$2N17034: length 4.3
  Top Layer w0.254: U1.31 14.5,24.79 14.25,25.05 11.7,25.05 C3.2
$2N17046: length 3.5
  Top Layer w0.254: U1.47 10.45,14.75 10,14.3 C4.1
$2N17057: length 7.9
  Top Layer w0.203: C2.1 28.83,13.23 28.83,15.2 27.78,16.25 U1.5
$3N7256: length 4.1
  Bottom Layer w0.254: 22.31,25.63 22.32,25.64 22.32,25.62 22.31,25.63 ; 22.31,25.63 22.31,25.62 22.19,25.5 ; 22.31,25.63 22.19,25.51 22.19,25.5 ; 22.19,25.5 20.25,23.57 U9.52 ; 22.19,25.5 22.19,25.35
$3N7259: length 15.2
  Bottom Layer w0.203: L2.1 27.07,20.59 D4.1 24.26,20.8 20.41,20.8 19.75,21.46 U9.51 U9.50
  Bottom Layer w0.254: U9.50 19.25,23.67 19.89,24.31 20.25,24.31 21.41,25.47 21.41,26.15 C28.2
$3N7261: length 7.1
  Bottom Layer w0.254: 18.25,23.14 18.25,23.57 19.48,24.8 20,24.8 20.31,25.11 20.31,28.38 C23.1
$3N7263: length 6.4
  Bottom Layer w0.254: 15.75,23.14 15.75,24.48 16.46,25.19 16.46,27.91 C24.2
$3N7265: length 6.3
  Bottom Layer w0.254: 13.25,23.14 13.25,24.98 12.9,25.33 12.9,27.79 C25.2
$3N7281: length 5.9
  Bottom Layer w0.203: U9.3 21.25,13.86 19.83,12.45 R10.1 19.52,12.45 R11.1
$3N7282: length 1.7
  Bottom Layer w0.254: R12.2 23.03,10.88 C16.1
$3N7283: length 4.6
  Bottom Layer w0.254: U9.1 22.25,13.8 22.75,13.3 23.85,13.3 R14.1
$3N7285: length 4.8
  Bottom Layer w0.254: U9.2 21.75,12.83 C18.1 23.08,12.46 R12.1
$3N7287: length 5.1
  Bottom Layer w0.254: R13.1 17.04,13.13 18.83,13.13 19.25,13.55 U9.7
$3N7289: length 8
  Bottom Layer w0.254: C19.1 11.19,10.99 11.75,11.55 11.75,12.55 12.27,13.07 14.5,13.07 15.75,14.32 U9.14
$3N7290: length 6.4
  Bottom Layer w0.254: C19.2 10.7,12.41 11.72,13.43 14.35,13.43 15.25,14.32 U9.15
$3N7291: length 5.4
  Bottom Layer w0.254: C14.2 C15.2 14.71,12.7 16.25,14.24 U9.13
$3N7294: length 6.5
  Bottom Layer w0.254: U9.24 10.75,14.53 10.27,14.05 9.25,14.05 ; 9.25,14.05 8.87,14.05 C20.2 ; 9.25,14.05 9.25,15.34 U9.27
$3N7296: length 4.5
  Bottom Layer w0.254: C17.2 8.99,13.08 9.6,13.69 10.7,13.69 11.25,14.24 U9.23
$3N10171: length 2
  Bottom Layer w0.254: C22.2 22.31,22.69 U9.56
$4N40844: length 21.2
  Top Layer w0.203: v1(14.01,26.39) 14.86,26.39 15.2,26.05 16.44,26.05 17.26,26.87 19.76,26.87 20.81,27.92 20.81,30.3 20.15,30.95 20.15,38.24 19.85,38.55 19.05,38.55 v1(19,38.59)
  Bottom Layer w0.254: R31.2 v1(14.01,26.39)
  Bottom Layer w0.595: 19.87,38.59 v1(19,38.59)
$4N41325: length 26.1
  Top Layer w0.203: v1(27.75,38.59) 28.45,38.59 28.81,38.24 28.81,31.18 29.31,30.68 29.31,27.75 28.28,26.73 20.66,26.73 19.73,25.8 18.06,25.8 v1(17.5,26.36)
  Bottom Layer w0.254: v1(17.5,26.36) 17.5,27.05 R26.2
  Bottom Layer w0.595: Q2.4 27.76,38.6 v1(27.75,38.59)
$4N41715: length 17.4
  Top Layer w0.203: v1(18.91,37.55) 19.5,37.55 19.85,37.2 19.85,30.7 20.5,30.05 20.5,28.11 19.68,27.3 17.18,27.3 16.42,26.53 v1(15.7,26.53)
  Bottom Layer w0.203: v1(15.7,26.53) 15.7,27.01 R30.2
  Bottom Layer w0.595: 18.91,36.71 v1(18.91,37.55)
$4N41799: length 22.4
  Top Layer w0.203: v1(27.42,37.55) 28,37.55 28.5,37.05 28.5,31.05 29,30.55 29,27.88 28.15,27.03 20.46,27.03 19.81,26.39 v1(19.42,26.39)
  Bottom Layer w0.203: R25.2 19.42,27.03 v1(19.42,26.39)
  Bottom Layer w0.595: 27.42,36.71 v1(27.42,37.55)
$4N42241: length 12.3
  Top Layer w0.203: v1(11.89,27.8) 11.89,29.91 11.25,30.55 11.25,37.05 10.75,37.55 v1(10.16,37.55)
  Bottom Layer w0.203: R33.2 v1(11.89,27.8)
  Bottom Layer w0.595: 10.16,36.71 v1(10.16,37.55)
$4N42270: length 17
  Top Layer w0.203: v1(10.25,26.39) 11.84,26.39 12.37,26.91 12.37,29.86 11.56,30.67 11.56,38.24 11.2,38.59 v1(10.25,38.59)
  Bottom Layer w0.254: v1(10.25,26.39) 10.25,27.09 R34.2
  Bottom Layer w0.595: Q6.4 v1(10.25,38.59)

## Copper pours and planes (outline as drawn; the poured copper is in the pictures)
+5V on Top Layer: 25.95,12.3 30.94,12.3 30.94,9.04 29.2,7.3 25.95,7.3
+5V on Bottom Layer: 28.12,12.27 31.95,12.27 31.95,10.03 29.95,8.02 28.12,8.02
+5V on Bottom Layer: 31.95,21.74 31.75,21.94 30.45,21.94 29.7,21.19 29.7,11.69 31.95,11.69
GND on Top Layer: -1.75,8.54 15.43,8.54 15.43,-1.75 -1.75,-1.75
GND on Bottom Layer: -3.75,55.25 39,55.25 39,-4.25 -3.75,-4.25
GND on Inner2: -4,52.75 37.5,52.75 37.5,-4.5 -4,-4.5
SH_A on Top Layer: 23.18,37.73 26.82,37.73 26.82,35.87 23.18,35.87
SH_A on Bottom Layer: 22.25,42.81 26.96,42.81 26.96,35.79 22.25,35.79
SH_B on Top Layer: 14.68,37.7 18.32,37.7 18.32,35.84 14.68,35.84
SH_B on Bottom Layer: 13.75,42.78 18.46,42.78 18.46,35.76 13.75,35.76
SH_C on Top Layer: 5.93,37.66 9.57,37.66 9.57,35.81 5.93,35.81
SH_C on Bottom Layer: 5,42.75 9.71,42.75 9.71,35.73 5,35.73
SUPPLY on Top Layer: 29.5,35.16 29.84,35.51 33.74,35.51 34.25,35 34.25,1 32.5,-0.75 18.68,-0.75 17.7,0.22 17.7,5.2 19.25,6.75 29.5,6.75 31.23,8.48 31.23,25.48 30.47,26.25 30,26.25 29.5,26.75
SUPPLY on Bottom Layer: 24.74,31.82 26.64,29.92 26.64,27.08 27.72,26 34.25,26 34.75,26.5 34.75,35.25 34.5,35.5 27.08,35.5 24.74,33.16
SUPPLY on Bottom Layer: 5.42,34.58 6.35,35.5 33,35.5 34.75,33.75 34.75,32 33.25,30.5 5.91,30.5 5.42,30.99
SUPPLY on Bottom Layer: 29.5,35.16 29.84,35.51 33.74,35.51 34.25,35 34.25,1 32.5,-0.75 19.93,-0.75 19.93,5.68 21,6.75 29.5,6.75 32.25,9.5 32.25,24.47 30.47,26.25 30,26.25 29.5,26.75
SUPPLY on Inner1: 29.5,35.16 29.84,35.51 33.74,35.51 34.25,35 34.25,1 32.5,-0.75 19.93,-0.75 19.93,5.68 21,6.75 29.5,6.75 31.23,8.48 31.23,25.48 30.47,26.25 30,26.25 29.5,26.75
SUPPLY on Inner2: 29.5,35.16 29.84,35.51 33.74,35.51 34.25,35 34.25,1 32.5,-0.75 19.93,-0.75 19.93,5.68 21,6.75 29.5,6.75 31.23,8.48 31.23,25.48 30.47,26.25 30,26.25 29.5,26.75
$3N7259 on Bottom Layer: 19.89,24.49 19.87,24.49 19.09,23.72 19.09,20.05 19.7,19.44 27.95,19.44 28.45,19.94 28.45,21.44 27.95,21.94 26.45,21.94 25.95,21.44 20.45,21.44 19.89,22

Small or netless copper shapes (teardrops, artwork), in the pictures only: 222 on Top Layer, 166 on Bottom Layer, 33 on Inner1

## Text on the board
Bottom Silkscreen Layer: 3V3 | A | GND | B | NTC | NC | DIO | CLK | CANH | CANL | crower / xjh356 / zyt | V5 / 250904
Top Silkscreen Layer: NJUPT / Potential | BOOT | NRST | C | B | A | + | - | NO. | N630
